# Altium project uz_frontpanel_main.PrjPCB (part 2 of 3)

## Sheet FPC-isoIOs-IOpSingle.SchDoc
size A4; SheetNumber: 8; SheetTotal: 15
Used 16 times, as channels U_FrontPanelConnectors/U_FPC-isoIOs/U_FPC-isoIOs-IOpQuad0104/IOp1, U_FrontPanelConnectors/U_FPC-isoIOs/U_FPC-isoIOs-IOpQuad0104/IOp2, U_FrontPanelConnectors/U_FPC-isoIOs/U_FPC-isoIOs-IOpQuad0104/IOp3, U_FrontPanelConnectors/U_FPC-isoIOs/U_FPC-isoIOs-IOpQuad0104/IOp4, U_FrontPanelConnectors/U_FPC-isoIOs/U_FPC-isoIOs-IOpQuad0508/IOp1, U_FrontPanelConnectors/U_FPC-isoIOs/U_FPC-isoIOs-IOpQuad0508/IOp2, U_FrontPanelConnectors/U_FPC-isoIOs/U_FPC-isoIOs-IOpQuad0508/IOp3, U_FrontPanelConnectors/U_FPC-isoIOs/U_FPC-isoIOs-IOpQuad0508/IOp4, U_FrontPanelConnectors/U_FPC-isoIOs/U_FPC-isoIOs-IOpQuad0912/IOp1, U_FrontPanelConnectors/U_FPC-isoIOs/U_FPC-isoIOs-IOpQuad0912/IOp2, U_FrontPanelConnectors/U_FPC-isoIOs/U_FPC-isoIOs-IOpQuad0912/IOp3, U_FrontPanelConnectors/U_FPC-isoIOs/U_FPC-isoIOs-IOpQuad0912/IOp4, U_FrontPanelConnectors/U_FPC-isoIOs/U_FPC-isoIOs-IOpQuad1316/IOp1, U_FrontPanelConnectors/U_FPC-isoIOs/U_FPC-isoIOs-IOpQuad1316/IOp2, U_FrontPanelConnectors/U_FPC-isoIOs/U_FPC-isoIOs-IOpQuad1316/IOp3, U_FrontPanelConnectors/U_FPC-isoIOs/U_FPC-isoIOs-IOpQuad1316/IOp4. Parts and nets are listed once, with the designators drawn on the sheet.
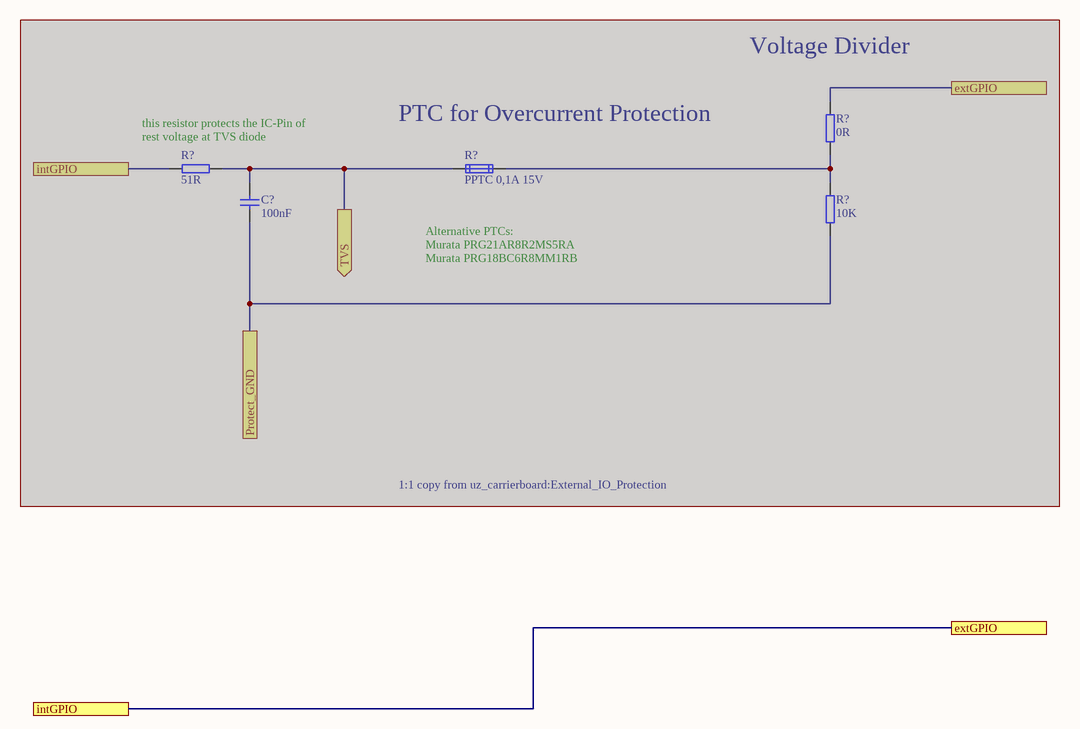
[diagram p8: FPC-isoIOs-IOpSingle.SchDoc]

### Parts
(Parts that share a designator on the sheet are numbered #1, #2 ... from top to bottom, then left to right.)
C?  100nF  [CAPC1608X90N_V]  (masked out: inside a compile mask, not in the netlist)
R?#1  0R  [RESC1608X55N_V]  (masked out: inside a compile mask, not in the netlist)
R?#2  51R  [RESC1608X55N_V]  (masked out: inside a compile mask, not in the netlist)
R?#3  PPTC 0,1A 15V  [RESC2012X85N]  (masked out: inside a compile mask, not in the netlist)
R?#4  10K  [RESC1608X55N_V]  (masked out: inside a compile mask, not in the netlist)

### Ports
extGPIO, intGPIO, Protect_GND, TVS (out)

### Nets
extGPIO: port intGPIO, port extGPIO

### Channels
U_FrontPanelConnectors/U_FPC-isoIOs/U_FPC-isoIOs-IOpQuad0104/IOp1: designators C?=C?A R?=R?A#3 R?=R?A#2 R?=R?A#4 R?=R?A#1; ports extGPIO=pExtStop intGPIO=pExtStop
U_FrontPanelConnectors/U_FPC-isoIOs/U_FPC-isoIOs-IOpQuad0104/IOp2: designators C?=C?B R?=R?B#3 R?=R?B#2 R?=R?B#4 R?=R?B#1; ports extGPIO=Extra01 intGPIO=Extra01
U_FrontPanelConnectors/U_FPC-isoIOs/U_FPC-isoIOs-IOpQuad0104/IOp3: designators C?=C?C R?=R?C#3 R?=R?C#2 R?=R?C#4 R?=R?C#1; ports extGPIO=Extra02 intGPIO=Extra02
U_FrontPanelConnectors/U_FPC-isoIOs/U_FPC-isoIOs-IOpQuad0104/IOp4: designators C?=C?D R?=R?D#3 R?=R?D#2 R?=R?D#4 R?=R?D#1; ports extGPIO=IO01 intGPIO=IO01
U_FrontPanelConnectors/U_FPC-isoIOs/U_FPC-isoIOs-IOpQuad0508/IOp1: designators C?=C?E R?=R?E#3 R?=R?E#2 R?=R?E#4 R?=R?E#1; ports extGPIO=IO02 intGPIO=IO02
U_FrontPanelConnectors/U_FPC-isoIOs/U_FPC-isoIOs-IOpQuad0508/IOp2: designators C?=C?F R?=R?F#3 R?=R?F#2 R?=R?F#4 R?=R?F#1; ports extGPIO=IO03 intGPIO=IO03
U_FrontPanelConnectors/U_FPC-isoIOs/U_FPC-isoIOs-IOpQuad0508/IOp3: designators C?=C?G R?=R?G#3 R?=R?G#2 R?=R?G#4 R?=R?G#1; ports extGPIO=IO04 intGPIO=IO04
U_FrontPanelConnectors/U_FPC-isoIOs/U_FPC-isoIOs-IOpQuad0508/IOp4: designators C?=C?H R?=R?H#3 R?=R?H#2 R?=R?H#4 R?=R?H#1; ports extGPIO=IO05 intGPIO=IO05
U_FrontPanelConnectors/U_FPC-isoIOs/U_FPC-isoIOs-IOpQuad0912/IOp1: designators C?=C?I R?=R?I#3 R?=R?I#2 R?=R?I#4 R?=R?I#1; ports extGPIO=IO06 intGPIO=IO06
U_FrontPanelConnectors/U_FPC-isoIOs/U_FPC-isoIOs-IOpQuad0912/IOp2: designators C?=C?J R?=R?J#3 R?=R?J#2 R?=R?J#4 R?=R?J#1; ports extGPIO=IO07 intGPIO=IO07
U_FrontPanelConnectors/U_FPC-isoIOs/U_FPC-isoIOs-IOpQuad0912/IOp3: designators C?=C?K R?=R?K#3 R?=R?K#2 R?=R?K#4 R?=R?K#1; ports extGPIO=IO08 intGPIO=IO08
U_FrontPanelConnectors/U_FPC-isoIOs/U_FPC-isoIOs-IOpQuad0912/IOp4: designators C?=C?L R?=R?L#3 R?=R?L#2 R?=R?L#4 R?=R?L#1; ports extGPIO=FlexIO01 intGPIO=FlexIO01
U_FrontPanelConnectors/U_FPC-isoIOs/U_FPC-isoIOs-IOpQuad1316/IOp1: designators C?=C?M R?=R?M#3 R?=R?M#2 R?=R?M#4 R?=R?M#1; ports extGPIO=FlexIO02 intGPIO=FlexIO02
U_FrontPanelConnectors/U_FPC-isoIOs/U_FPC-isoIOs-IOpQuad1316/IOp2: designators C?=C?N R?=R?N#3 R?=R?N#2 R?=R?N#4 R?=R?N#1; ports extGPIO=FlexIO03 intGPIO=FlexIO03
U_FrontPanelConnectors/U_FPC-isoIOs/U_FPC-isoIOs-IOpQuad1316/IOp3: designators C?=C?O R?=R?O#3 R?=R?O#2 R?=R?O#4 R?=R?O#1; ports extGPIO=FlexIO04 intGPIO=FlexIO04
U_FrontPanelConnectors/U_FPC-isoIOs/U_FPC-isoIOs-IOpQuad1316/IOp4: designators C?=C?P R?=R?P#3 R?=R?P#2 R?=R?P#4 R?=R?P#1; ports extGPIO=FlexIO05 intGPIO=FlexIO05

### Notes on the sheet
- Voltage Divider
- (near R?#2) this resistor protects the IC-Pin of rest voltage at TVS diode
- (near R?#3) PTC for Overcurrent Protection
- Alternative PTCs:
  Murata PRG21AR8R2MS5RA
  Murata PRG18BC6R8MM1RB
- 1:1 copy from uz_carrierboard:External_IO_Protection
- Title
- Revision:
- Design Engineer:
- Date:
- Project:
- Sheet
- of

### Library data of the parts
C? = 21382: KON 100nF 50V X7R ±10% SMD BF 1608 (0603); Value: 100n; AN: 21382; Mixed: SMT; Preferred: Yes; Temperature-Range: -55/+125; Tolerance: ±10%; Voltage: 50V; Technology: X7R; Case: 1608 (0603)
R?#1 = 21491: WID SMD 0R 0,1W 1% TK100  BF 1608 (0603); Value: 0; AN: 21491; Mixed: SMT; Tolerance: 1%; Case: 1608 (0603); Technology: TK100
R?#2 = 25938: WID SMD 51R 1% 0,1W  BF 1608 (0603); Value: 51; AN: 25938; Mixed: SMT; Preferred: Yes; Tolerance: 1%; Case: 1608 (0603); Technology: TK100
R?#3 = 28044: PTC Resettable Fuse 0.1A 15V SMD 0805; AN: 28044; Mixed: SMT; H-ART: MF-PSMF010X-2; Value: 0.1A; HelpURL: B:\AD\adlib\datasheet\MF-PSMF; Case: 2012 (0805); Voltage: 15V; Extra: MF-PSMF010X-2
R?#4 = 21492: WID SMD 10K 1% 0,1W  BF 1608 (0603); AN: 21492; Mixed: SMT; Preferred: Yes; Value: 10K; Tolerance: 1%; Case: 1608 (0603); Technology: TK100

## Sheet FPC-isoIOs-Power_Protection_AP22653.SchDoc
size A4; SheetNumber: 9; SheetTotal: 15
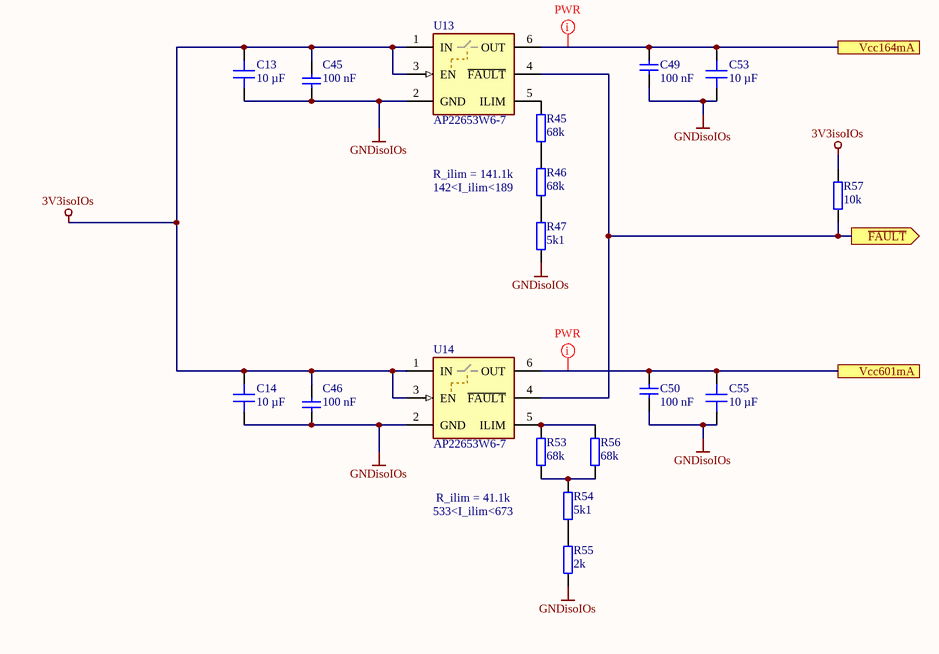
[diagram p9: FPC-isoIOs-Power_Protection_AP22653.SchDoc]

### Parts
C13  10 µF  [C_0603_TE]
C14  10 µF  [C_0603_TE]
C45  100 nF  [C_0603_TE]
C46  100 nF  [C_0603_TE]
C49  100 nF  [C_0603_TE]
C50  100 nF  [C_0603_TE]
C53  10 µF  [C_0603_TE]
C55  10 µF  [C_0603_TE]
R45  68k  [R_0603_TE]
R46  68k  [R_0603_TE]
R47  5k1  [R_0603_TE]
R53  68k  [R_0603_TE]
R54  5k1  [R_0603_TE]
R55  2k  [R_0603_TE]
R56  68k  [R_0603_TE]
R57  10k  [R_0603_TE]
U13  AP22653W6-7  [TSOT26-6]
U14  AP22653W6-7  [TSOT26-6]

### Ports
Vcc164mA, Vcc601mA, ~{FAULT} (out)

### Nets
3V3isoIOs: C13.2 C14.2 C45.1 C46.1 R57.2 U13.1(IN) U13.3(EN) U14.1(IN) U14.3(EN)
3V3isoIOs1: C49.1 C53.2 U13.6(OUT) ; port Vcc164mA
3V3isoIOs2: C50.1 C55.2 U14.6(OUT) ; port Vcc601mA
GNDisoIOs: C13.1 C14.1 C45.2 C46.2 C49.2 C50.2 C53.1 C55.1 R47.1 R55.1 U13.2(GND) U14.2(GND)
~{FAULT}: R57.1 U13.4(~{FAULT}) U14.4(~{FAULT}) ; port ~{FAULT}
NetR45_1: R45.1 R46.2
NetR45_2: R45.2 U13.5(ILIM)
NetR46_1: R46.1 R47.2
NetR53_1: R53.1 R54.2 R56.1
NetR53_2: R53.2 R56.2 U14.5(ILIM)
NetR54_1: R54.1 R55.2

### Layout directives
net class PWR: 3V3isoIOs1, 3V3isoIOs2

### Notes on the sheet
- R_ilim = 141.1k
- 142<I_ilim<189
- R_ilim = 41.1k
- 533<I_ilim<673
- Title
- Revision:
- Design Engineer:
- Date:
- Project:
- Sheet
- of

### Library data of the parts
C13 C14 C53 C55 = CL10A106MO8NQNC: as C24 on sheet FPC-isoIOs; Manufacturer Part Number: CL10A106MO8NQNC; PartID: 101; Created On: 22/08/2022 13:56:44; ComponentLink1Description: Datasheet; ComponentLink1URL: https://datasheet.lcsc.com/lcsc/1810261909_Samsung-Electro-Mechanics-CL10A106MO8NQNC_C92487.pdf; Component Type: Capacitor 0603; Device Package: 0603; Last Updated: 19/11/2024 12:40:46; Mounting Type: SMD; Operating Temperature: -55 - 85°C; Series: X5R; Supplier 1: LCSC; Supplier Part Number 1: C92487; Type: Capacitor; Value: 10 µF; Live Cycle Status: 1; LCSC Part Number: C92487
C45 C46 C49 C50 = UZgen_C_0603_100nF_50V_X7R: as C21 on sheet FPC-isoIOs; Manufacturer Part Number: UZgen_C_0603_100nF_50V_X7R; PartID: 1; Created On: 02/07/2024 14:42:23; Value: 100 nF; Device Package: 0603; Technology: X7R; Mounting Type: SMD; Last Updated: 08/08/2024 15:01:15
R45 R46 R53 R56 = UZgen_R_0603_68k: Generic resistor; Manufacturer: UZgen; Tolerance: 1 %; Created from: UZgenTool; Manufacturer Part Number: UZgen_R_0603_68k; PartID: 264; Created On: 02/07/2024 17:29:50; Value: 68k; Device Package: 0603; Mounting Type: SMD; Last Updated: 02/07/2024 17:29:50
R47 R54 = UZgen_R_0603_5k1: Generic resistor; Manufacturer: UZgen; Tolerance: 1 %; Created from: UZgenTool; Manufacturer Part Number: UZgen_R_0603_5k1; PartID: 238; Created On: 02/07/2024 17:29:50; Value: 5k1; Device Package: 0603; Mounting Type: SMD; Last Updated: 02/07/2024 17:29:50
R55 = UZgen_R_0603_2k: Generic resistor; Manufacturer: UZgen; Tolerance: 1 %; Created from: UZgenTool; Manufacturer Part Number: UZgen_R_0603_2k; PartID: 228; Created On: 02/07/2024 17:29:49; Value: 2k; Device Package: 0603; Mounting Type: SMD; Last Updated: 02/07/2024 17:29:49
R57 = UZgen_R_0603_10k: as R18 on sheet FPC-isoIOs; Manufacturer Part Number: UZgen_R_0603_10k; PartID: 1; Created On: 02/07/2024 14:34:53; Value: 10k; Device Package: 0603; Mounting Type: SMD; Last Updated: 02/07/2024 14:37:16
U13 U14 = AP22653W6-7: Precision Adjustable Current-limited Power Switch; Manufacturer: Diodes Incorporated; Created from: MGeier; Manufacturer Part Number: AP22653W6-7; PartID: 10; Created On: 10/04/2025 19:40:00; ComponentLink1Description: Datasheet; ComponentLink1URL: https://www.diodes.com/datasheet/download/AP22652_AP22653_AP22652A_AP22653A.pdf; ComponentLink2Description: Homepage; ComponentLink2URL: https://www.diodes.com/part/view/AP22653; Component Type: Power Switch ICs; Device Package: SOT26; Last Updated: 11/04/2025 15:13:45; Mounting Type: SMD; Operating Temperature: -40 to +125 °C; Series: AP22652/AP22653/AP22652A/AP22653A; Supplier 1: LCSC; Supplier Part Number 1: C2158037; Value: AP22653W6-7; LCSC Part Number: C2158037

## Sheet ETH-PHY_SGMII.SchDoc
size A4; Organization: UltraZohm; SheetNumber: 11; SheetTotal: 15
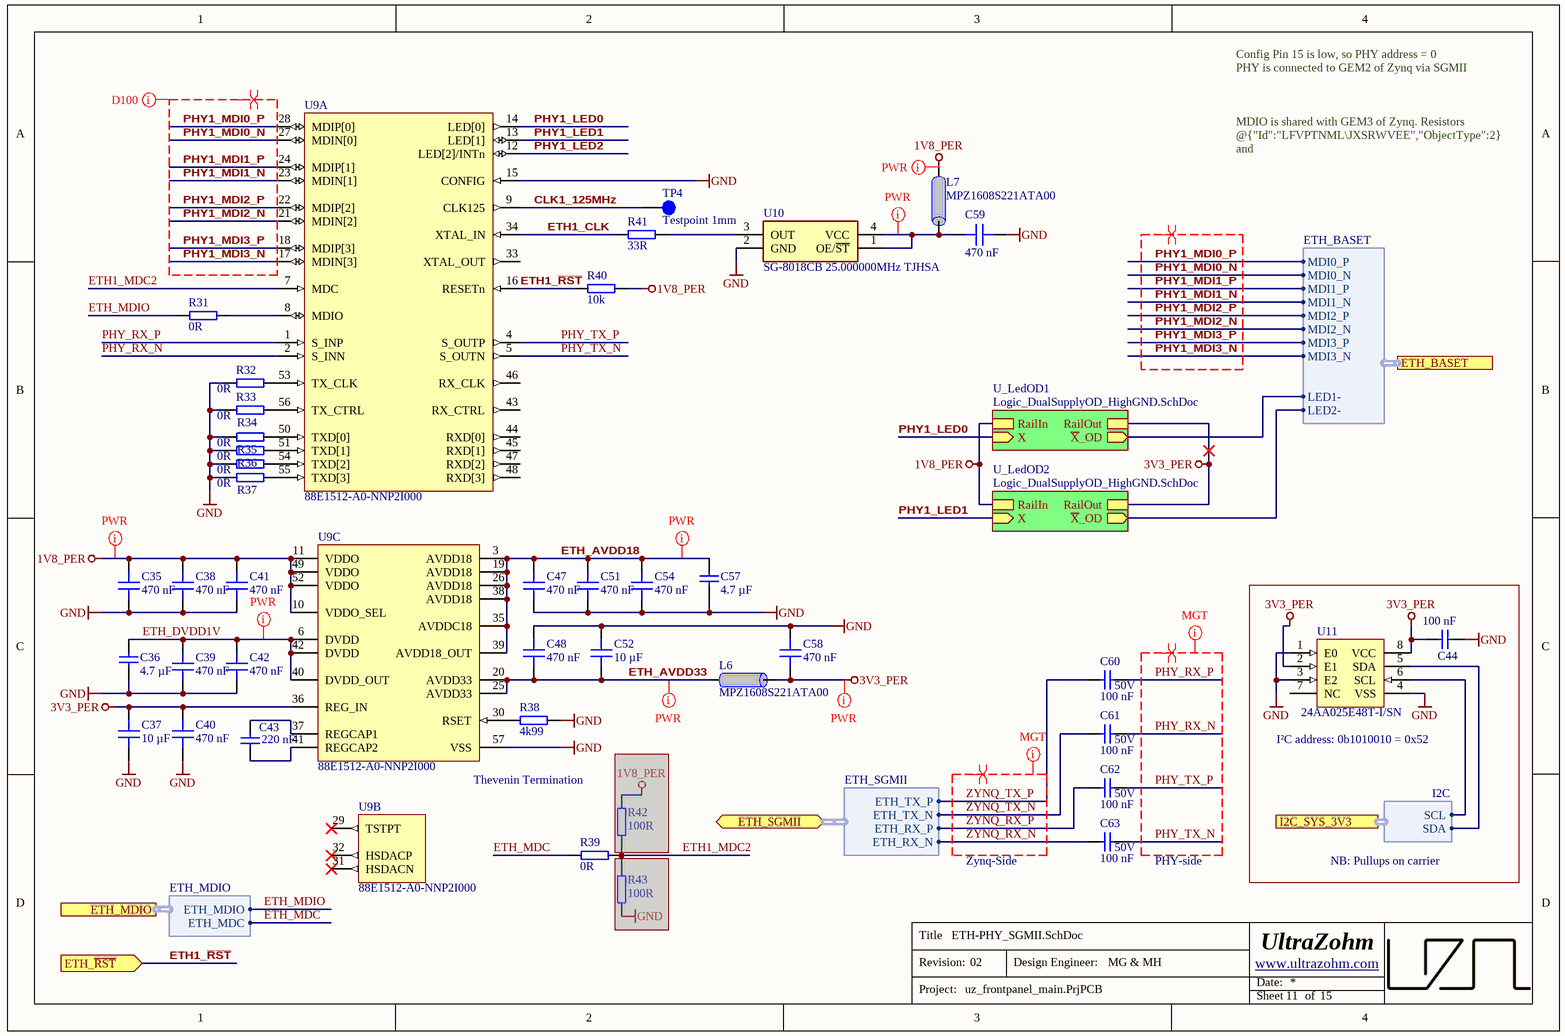
[diagram p10: ETH-PHY_SGMII.SchDoc]

### Parts
(Parts that share a designator on the sheet are numbered #1, #2 ... from top to bottom, then left to right.)
C35  470 nF  [C_0603_TE]
C36  4.7 µF  [C_0603_TE]
C37  10 µF  [C_0603_TE]
C38  470 nF  [C_0603_TE]
C39  470 nF  [C_0603_TE]
C40  470 nF  [C_0603_TE]
C41  470 nF  [C_0603_TE]
C42  470 nF  [C_0603_TE]
C43  220 nF  [C_0603_TE]
C44  100 nF  [C_0603_TE]
C47  470 nF  [C_0603_TE]
C48  470 nF  [C_0603_TE]
C51  470 nF  [C_0603_TE]
C52  10 µF  [C_0603_TE]
C54  470 nF  [C_0603_TE]
C57  4.7 µF  [C_0603_TE]
C58  470 nF  [C_0603_TE]
C59  470 nF  [C_0603_TE]
C60  100 nF  Voltage: 50V  [C_0402_TE]
C61  100 nF  Voltage: 50V  [C_0402_TE]
C62  100 nF  Voltage: 50V  [C_0402_TE]
C63  100 nF  Voltage: 50V  [C_0402_TE]
L6  MPZ1608S221ATA00  [RES 0603_1608]
L7  MPZ1608S221ATA00  [RES 0603_1608]
R31  0R  [R_0603_TE]
R32  0R  [R_0603_TE]
R33  0R  [R_0603_TE]
R34  0R  [R_0603_TE]
R35  0R  [R_0603_TE]
R36  0R  [R_0603_TE]
R37  0R  [R_0603_TE]
R38  4k99  [RES 0603_1608]
R39  0R  [R_0603_TE]
R40  10k  [R_0603_TE]
R41  33R  [R_0603_TE]
R42#2  100R  [R_0603_TE]  (masked out: inside a compile mask, not in the netlist)
R43#2  100R  [R_0603_TE]  (masked out: inside a compile mask, not in the netlist)
TP4  Testpoint 1mm  [TP_1mm]  (no BOM)
U9  88E1512-A0-NNP2I000  [QFN50P800X800X100-57N]  (parts A,B,C of 3)
U10  SG-8018CB 25.000000MHz TJHSA  [SMD5032-4P]
U11  24AA025E48T-I/SN  [D0008A_N]

### Sub-sheets
U_LedOD1 = Logic_DualSupplyOD_HighGND.SchDoc (file not in this document): RailIn, RailOut, X (in), ~{X}_OD (out)
U_LedOD2 = Logic_DualSupplyOD_HighGND.SchDoc (file not in this document): RailIn, RailOut, X (in), ~{X}_OD (out)

### Ports
ETH_BASET (harness ETH_BASET), ETH_MDIO (harness ETH_MDIO), ETH_SGMII (bidir, harness ETH_SGMII), ETH_~{RST} (in), I2C_SYS_3V3 (harness I2C)

### Harnesses
ETH_SGMII: ETH_RX_N, ETH_RX_P, ETH_TX_N, ETH_TX_P
ETH_MDIO: ETH_MDC, ETH_MDIO
ETH_BASET: MDI0_P, MDI0_N, MDI1_P, MDI1_N, MDI2_P, MDI2_N, MDI3_P, MDI3_N, LED1-, LED2-
I2C: SCL, SDA

### Nets
1V8_PER: C35.1 C38.1 C41.1 L7.1 R40.2 U9.10(VDDO_SEL) U9.11(VDDO) U9.49(VDDO) U9.52(VDDO) ; sheet U_LedOD1/RailIn, sheet U_LedOD2/RailIn
3V3_PER: C37.1 C40.1 C44.1 C58.2 L6.2 U9.36(REG_IN) U11.2(E1) U11.8(VCC) ; sheet U_LedOD1/RailOut, sheet U_LedOD2/RailOut
GND: C35.2 C36.2 C37.2 C38.2 C39.2 C40.2 C41.2 C42.2 C44.2 C47.2 C48.1 C51.2 C52.1 C54.2 C57.2 C58.1 C59.1 R32.1 R33.1 R34.1 R35.1 R36.1 R37.1 R38.1 U9.15(CONFIG) U9.57(VSS) U10.2(GND) U11.1(E0) U11.3(E2) U11.4(VSS)
1R_LED1-: sheet U_LedOD1/~{X}_OD, port ETH_BASET.LED1-
1R_LED2-: sheet U_LedOD2/~{X}_OD, port ETH_BASET.LED2-
CLK1_125MHz: TP4.1 U9.9(CLK125)
ETH1_CLK: R41.1 U9.34(XTAL_IN)
ETH1_MDC2: R39.2 U9.7(MDC)
ETH1_~{RST}: R40.1 U9.16(RESETn) ; port ETH_~{RST}
ETH_AVDD18: C47.1 C51.1 C54.1 C57.1 U9.3(AVDD18) U9.19(AVDD18) U9.26(AVDD18) U9.35(AVDDC18) U9.38(AVDD18) U9.39(AVDD18_OUT)
ETH_AVDD33: C48.2 C52.2 L6.1 U9.20(AVDD33) U9.25(AVDD33)
ETH_DVDD1V: C36.1 C39.1 C42.1 U9.6(DVDD) U9.40(DVDD_OUT) U9.42(DVDD)
ETH_MDC: R39.1 ; port ETH_MDIO.ETH_MDC  [project net ETH1_MDC]
ETH_MDIO: R31.1 ; port ETH_MDIO.ETH_MDIO  [project net ETH1_MDIO]
I2C_SYS_3V3.SCL: U11.6(SCL) ; port I2C_SYS_3V3.SCL
I2C_SYS_3V3.SDA: U11.5(SDA) ; port I2C_SYS_3V3.SDA
PHY1_LED0: U9.14(LED[0]) ; sheet U_LedOD1/X
PHY1_LED1: U9.13(LED[1]) ; sheet U_LedOD2/X
PHY1_LED2: U9.12(LED[2]/INTn)
PHY1_MDI0_N: U9.27(MDIN[0]) ; port ETH_BASET.MDI0_N  [project net MDI1R_0_N]
PHY1_MDI0_P: U9.28(MDIP[0]) ; port ETH_BASET.MDI0_P  [project net MDI1R_0_P]
PHY1_MDI1_N: U9.23(MDIN[1]) ; port ETH_BASET.MDI1_N  [project net MDI1R_1_N]
PHY1_MDI1_P: U9.24(MDIP[1]) ; port ETH_BASET.MDI1_P  [project net MDI1R_1_P]
PHY1_MDI2_N: U9.21(MDIN[2]) ; port ETH_BASET.MDI2_N  [project net MDI1R_2_N]
PHY1_MDI2_P: U9.22(MDIP[2]) ; port ETH_BASET.MDI2_P  [project net MDI1R_2_P]
PHY1_MDI3_N: U9.17(MDIN[3]) ; port ETH_BASET.MDI3_N  [project net MDI1R_3_N]
PHY1_MDI3_P: U9.18(MDIP[3]) ; port ETH_BASET.MDI3_P  [project net MDI1R_3_P]
PHY_RX_N: C61.2 U9.2(S_INN)
PHY_RX_P: C60.2 U9.1(S_INP)
PHY_TX_N: C63.2 U9.5(S_OUTN)
PHY_TX_P: C62.2 U9.4(S_OUTP)
ZYNQ_RX_N: C63.1 ; port ETH_SGMII.ETH_RX_N  [project net GTR2_RX_N]
ZYNQ_RX_P: C62.1 ; port ETH_SGMII.ETH_RX_P  [project net GTR2_RX_P]
ZYNQ_TX_N: C61.1 ; port ETH_SGMII.ETH_TX_N  [project net GTR2_TX_N]
ZYNQ_TX_P: C60.1 ; port ETH_SGMII.ETH_TX_P  [project net GTR2_TX_P]
NetC43_1: C43.1 U9.37(REGCAP1)
NetC43_2: C43.2 U9.41(REGCAP2)
NetC59_2: C59.2 L7.2 U10.1(OE/~{ST}) U10.4(VCC)
NetR31_2: R31.2 U9.8(MDIO)
NetR32_2: R32.2 U9.53(TX_CLK)
NetR33_2: R33.2 U9.56(TX_CTRL)
NetR34_2: R34.2 U9.50(TXD[0])
NetR35_2: R35.2 U9.51(TXD[1])
NetR36_2: R36.2 U9.54(TXD[2])
NetR37_2: R37.2 U9.55(TXD[3])
NetR38_2: R38.2 U9.30(RSET)
NetR41_2: R41.2 U10.3(OUT)

Not connected (* = marked no-connect by the designer): U9 29(TSTPT)* 31(HSDACN)* 32(HSDACP)* 33(XTAL_OUT) 43(RX_CTRL) 44(RXD[0]) 45(RXD[1]) 46(RX_CLK) 47(RXD[2]) 48(RXD[3]); U11 7(NC)

### Layout directives
differential pair: PHY1_MDI0_N, PHY1_MDI0_P, PHY1_MDI1_N, PHY1_MDI1_P, PHY1_MDI2_N, PHY1_MDI2_P, PHY1_MDI3_N, PHY1_MDI3_P, PHY_RX_N, PHY_RX_P, PHY_TX_N, PHY_TX_P, ZYNQ_RX_N, ZYNQ_RX_P, ZYNQ_TX_N, ZYNQ_TX_P
net class D100: PHY1_MDI0_N, PHY1_MDI0_P, PHY1_MDI1_N, PHY1_MDI1_P, PHY1_MDI2_N, PHY1_MDI2_P, PHY1_MDI3_N, PHY1_MDI3_P
net class MGT: PHY_RX_N, PHY_RX_P, PHY_TX_N, PHY_TX_P, ZYNQ_RX_N, ZYNQ_RX_P, ZYNQ_TX_N, ZYNQ_TX_P
net class PWR: 1V8_PER, 3V3_PER, ETH_AVDD18, ETH_AVDD33, ETH_DVDD1V, NetC59_2

### Notes on the sheet
- Config Pin 15 is low, so PHY address = 0
  PHY is connected to GEM2 of Zynq via SGMII
  MDIO is shared with GEM3 of Zynq. Resistors @{"Id":"LFVPTNML\JXSRWVEE","ObjectType":2} and @{"Id":"LFVPTNML\HYAPWXBM","ObjectType":2} need to be soldered with 0R to be connected to the MDIO Bus
- Thevenin Termination
- (near U11) I²C address: 0b1010010 = 0x52
- Zynq-Side
- (near C63) PHY-side
- NB: Pullups on carrier
- Title
- Revision:
- Design Engineer:
- Date:
- Project:
- Sheet
- of

### Library data of the parts
C35 C38-C42 C47 C48 C51 C54 C58 C59 = CL10A474KB8NNNC: Capacitor 0603, 50 VDC, 470 nF, X5R; Manufacturer: Samsung Electro-Mechanics; Tolerance: 10 %; Voltage Rating: 50 VDC; Created from: AGeiger; Manufacturer Part Number: CL10A474KB8NNNC; PartID: 103; Created On: 22/08/2022 14:44:45; ComponentLink1Description: Datasheet; ComponentLink1URL: https://datasheet.lcsc.com/lcsc/1810191213_Samsung-Electro-Mechanics-CL10A474KB8NNNC_C170149.pdf; Component Type: Capacitor 0603; Device Package: 0603; Last Updated: 22/04/2025 15:48:45; Mounting Type: SMD; Operating Temperature: -55 - 85°C; Series: X5R; Supplier 1: LCSC; Supplier Part Number 1: C170149; Supplier 2: Mouser; Supplier Part Number 2: 187-CL10A474KB8NNNC; Type: Capacitor; Value: 470 nF; Live Cycle Status: 1; LCSC Part Number: C170149
C36 C57 = UZgen_C_0603_4.7uF_16V_X5R: Generic capacitor; Manufacturer: UZgen; Tolerance: 10 %; Created from: MGeier; Voltage: 16V; Manufacturer Part Number: UZgen_C_0603_4.7uF_16V_X5R; PartID: 5809; Created On: 20/03/2025 14:43:45; Device Package: 0603; Last Updated: 20/03/2025 14:43:45; Mounting Type: SMD; Value: 4.7 µF; Technology: X5R
C37 C52 = CL10A106MO8NQNC: as C24 on sheet FPC-isoIOs; Manufacturer Part Number: CL10A106MO8NQNC; PartID: 101; Created On: 22/08/2022 13:56:44; ComponentLink1Description: Datasheet; ComponentLink1URL: https://datasheet.lcsc.com/lcsc/1810261909_Samsung-Electro-Mechanics-CL10A106MO8NQNC_C92487.pdf; Component Type: Capacitor 0603; Device Package: 0603; Last Updated: 19/11/2024 12:40:46; Mounting Type: SMD; Operating Temperature: -55 - 85°C; Series: X5R; Supplier 1: LCSC; Supplier Part Number 1: C92487; Type: Capacitor; Value: 10 µF; Live Cycle Status: 1; LCSC Part Number: C92487
C43 = UZgen_C_0603_220nF_50V_X7R: Generic capacitor; Manufacturer: UZgen; Tolerance: 10 %; Voltage: 50V; Created from: UZgenTool; Value: 220 nF; Technology: X7R; Manufacturer Part Number: UZgen_C_0603_220nF_50V_X7R; PartID: 2; Created On: 02/07/2024 14:42:23; Device Package: 0603; Mounting Type: SMD; Last Updated: 08/08/2024 15:01:15
C44 = UZgen_C_0603_100nF_50V_X7R: as C21 on sheet FPC-isoIOs; Manufacturer Part Number: UZgen_C_0603_100nF_50V_X7R; PartID: 1; Created On: 02/07/2024 14:42:23; Value: 100 nF; Device Package: 0603; Technology: X7R; Mounting Type: SMD; Last Updated: 08/08/2024 15:01:15
C60-C63 = UZgen_C_0402_100nF_50V_X7R: Generic capacitor; Manufacturer: UZgen; Tolerance: 10 %; Created from: UZgenTool; Technology: X7R; Value: 100 nF; Manufacturer Part Number: UZgen_C_0402_100nF_50V_X7R; PartID: 3431; Created On: 02/08/2024 11:17:51; Device Package: 0402; Mounting Type: SMD; Last Updated: 02/08/2024 11:17:51
L6 L7 = MPZ1608S221ATA00: Ferritperle, 0603, 220 ohm, 2.2 A, Baureihe MPZ, 0.05 ohm, ± 25%; Manufacturer: TDK; Value: 220 Ohm; Type: Ferrite; DC current: 2.2 A; Created from: MGremer; Manufacturer Part Number: MPZ1608S221ATA00; PartID: 3; Created On: 08/06/2021 11:33:39; ComponentLink1Description: Datasheet; ComponentLink1URL: http://www.farnell.com/datasheets/2291439.pdf; Component Type: Ferritperle; Device Package: 0603; Last Updated: 12/07/2024 17:26:54; Mounting Type: SMD; Operating Temperature: -55 - 125 °C; Series: MPZ; Supplier 1: Farnell; Supplier Part Number 1: 1301677RL; Live Cycle Status: 1; LCSC Part Number: C76815; Stock number: not stored
R31-R37 R39 = UZgen_R_0603_0R: Generic resistor; Manufacturer: UZgen; Tolerance: 1 %; Created from: UZgenTool; Value: 0R; Manufacturer Part Number: UZgen_R_0603_0R; PartID: 581; Created On: 08/07/2024 14:34:30; Device Package: 0603; Mounting Type: SMD; Last Updated: 08/07/2024 14:34:30
R38 = RC0603FR-074K99L: 100mW Thick Film Resistors 75V ±100ppm/℃ ±1% 4.99kΩ 0603 Chip Resistor - Surface Mount ROHS; Manufacturer: YAGEO; Created from: NDiringer; Tolerance: 1%; Value: 4k99; Manufacturer Part Number: RC0603FR-074K99L; PartID: 352; Created On: 17/08/2022 08:08:34; ComponentLink1Description: Datasheet; ComponentLink1URL: https://www.lcsc.com/datasheet/lcsc_datasheet_2304140030_YAGEO-RC0603FR-074K99L_C114621.pdf; Component Type: SMD resistor; Device Package: 0603; Last Updated: 17/08/2022 08:08:34; Mounting Type: SMD; Supplier 1: LCSC/JLCPCB; Supplier Part Number 1: C114621; Type: Resistor; Live Cycle Status: 1; Stock number: not stored; LCSC Part Number: C114621
R40 = UZgen_R_0603_10k: as R18 on sheet FPC-isoIOs; Value: 10k; Manufacturer Part Number: UZgen_R_0603_10k; PartID: 1; Created On: 02/07/2024 14:34:53; Device Package: 0603; Mounting Type: SMD; Last Updated: 02/07/2024 14:37:16
R41 = UZgen_R_0603_33R: Generic resistor; Manufacturer: UZgen; Tolerance: 1 %; Created from: UZgenTool; Value: 33R; Manufacturer Part Number: UZgen_R_0603_33R; PartID: 185; Created On: 02/07/2024 17:29:48; Device Package: 0603; Mounting Type: SMD; Last Updated: 02/07/2024 17:29:48
R42#2 R43#2 = UZgen_R_0603_100R: Generic resistor; Manufacturer: UZgen; Tolerance: 1 %; Created from: UZgenTool; Value: 100R; Manufacturer Part Number: UZgen_R_0603_100R; PartID: 197; Created On: 02/07/2024 17:29:48; Device Package: 0603; Mounting Type: SMD; Last Updated: 02/07/2024 17:29:48
TP4 = NULL: Manufacturer Part Number: NULL; Created from: AGeiger; Created: 2018_06_25_AGeiger; Value: Testpoint 1mm; PartID: 9; Created On: 20/09/2022 13:14:57; Component Type: Testpoint; Last Updated: 20/09/2022 13:15:39; Manufacturer: NULL; Supplier 1: NULL; Supplier Part Number 1: NULL; Type: Testpoint; Live Cycle Status: 1
U9 = 88E1512-A0-NNP2I000: Ethernet ICs Single-Port EEE GE PHY w/SGMII in 56-pin QFN; Manufacturer: Marvell; Created from: MGremer; Manufacturer Part Number: 88E1512-A0-NNP2I000; PartID: 1; Created On: 01/12/2020 16:21:41; ComponentLink1Description: Datasheet; ComponentLink1URL: https://www.mouser.de/datasheet/2/912/marvell-phys-transceivers-alaska-88e151x-datasheet-1360912.pdf; Component Type: Ethernet Single-Port; Device Package: QFN65; Last Updated: 26/06/2024 13:40:11; Mounting Type: SMD; Supplier 1: Mouser; Supplier Part Number 1: 348-88E1512A0NNP2I00; Type: Ethernet Single-Port; Live Cycle Status: 1; LCSC Part Number: C713256; Stock number: not stored
U10 = SG-8018CB 25.000000MHz TJHSA: ±50ppm 1.8V~3.3V 25MHz SMD5032-4P Programmable Oscillators ROHS; Manufacturer: Seiko Epson; Created from: FRosner; Manufacturer Part Number: SG-8018CB 25.000000MHz TJHSA; PartID: 3; Created On: 15/08/2024 10:38:39; ComponentLink1Description: Datasheet; ComponentLink1URL: https://download.epsondevice.com/td/pdf/app/SG-8018CB_en.pdf; Component Type: Oscillator; Device Package: 5032; Last Updated: 15/08/2024 10:38:39; Mounting Type: SMD; Operating Temperature: -40 to +105°C; Supplier 1: LCSC; Supplier Part Number 1: C390471; Value: 25 MHz; LCSC Part Number: C390471
U11 = 24AA025E48T-I/SN: 2Kbit I2C SOP-8 EEPROM ROHS; Manufacturer: Microchip Tech; Created from: FRosner; Manufacturer Part Number: 24AA025E48T-I/SN; PartID: 7; Created On: 07/09/2024 12:18:21; ComponentLink1Description: Datasheet; ComponentLink1URL: https://wmsc.lcsc.com/wmsc/upload/file/pdf/v2/lcsc/2202010930_Microchip-Tech-24AA025E48T-I-SN_C2060925.pdf; Component Type: EEPROM; Device Package: SOIC-8; Last Updated: 10/09/2024 09:33:15; Mounting Type: SMD; Operating Temperature: -40 to +85 °C; Series: 24AA025; Supplier 1: Mouser; Supplier Part Number 1: 579-24AA025E48T-I/SN; Supplier 2: LCSC; Supplier Part Number 2: C2060925; Type: Memory; Value: 24AA025E48T-I/SN; LCSC Part Number: C2060925

## Sheet PCB-FirstFloor.SchDoc
size A4; SheetNumber: 15; SheetTotal: 15
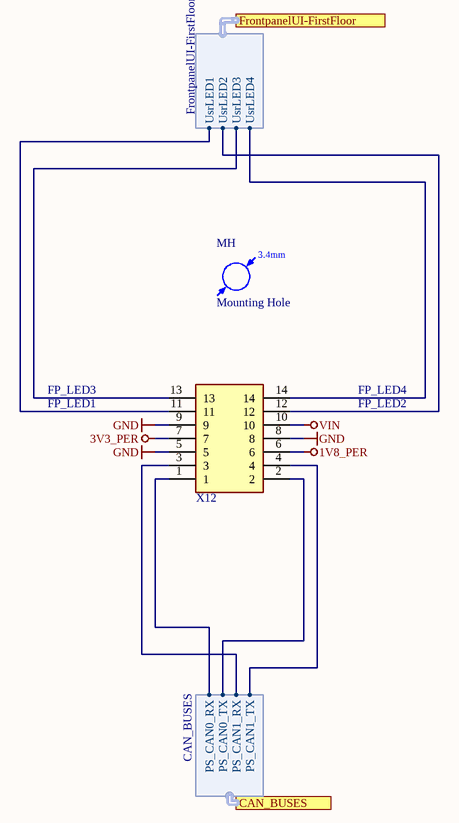
[diagram p11: PCB-FirstFloor.SchDoc]

### Parts
MH  Mounting Hole  [MH_3.4]  (no BOM)
X12  (no value)  [TE_215309-7]

### Ports
CAN_BUSES (harness CAN_BUSES), FrontpanelUI-FirstFloor (harness FrontpanelUI-FirstFloor)

### Harnesses
FrontpanelUI-FirstFloor: UsrLED1, UsrLED2, UsrLED3, UsrLED4
CAN_BUSES: PS_CAN0_RX, PS_CAN0_TX, PS_CAN1_RX, PS_CAN1_TX

### Nets
1V8_PER: X12.6
3V3_PER: X12.7
GND: X12.5 X12.8 X12.9
VIN: X12.10
CAN_BUSES.PS_CAN0_RX: X12.1 ; port CAN_BUSES.PS_CAN0_RX
CAN_BUSES.PS_CAN0_TX: X12.2 ; port CAN_BUSES.PS_CAN0_TX
CAN_BUSES.PS_CAN1_RX: X12.3 ; port CAN_BUSES.PS_CAN1_RX
CAN_BUSES.PS_CAN1_TX: X12.4 ; port CAN_BUSES.PS_CAN1_TX
FrontpanelUI-FF.UsrLED1: X12.11 ; port FrontpanelUI-FirstFloor.UsrLED1
FrontpanelUI-FF.UsrLED2: X12.12 ; port FrontpanelUI-FirstFloor.UsrLED2
FrontpanelUI-FF.UsrLED3: X12.13 ; port FrontpanelUI-FirstFloor.UsrLED3
FrontpanelUI-FF.UsrLED4: X12.14 ; port FrontpanelUI-FirstFloor.UsrLED4

### Notes on the sheet
- FP_LED1
- FP_LED3
- FP_LED2
- FP_LED4
- Title
- Revision:
- Design Engineer:
- Date:
- Project:
- Sheet
- of
- (in symbol Mounting Hole) 3.4mm

### Library data of the parts
MH = Mounting Hole: Created from: MHlatky; Manufacturer Part Number: Mounting Hole; PartID: 16; Created On: 26/01/2021 09:19:51; ComponentLink1Description: Datasheet; Component Type: Mounting Hole; Device Package: -; Last Updated: 21/03/2022 23:05:12; Manufacturer: Mounting Hole; Supplier 1: Mounting Hole; Supplier Part Number 1: Mounting Hole; Type: Mounting Hole; Value: Mounting Hole; Live Cycle Status: 1; Stock number: not stored
X12 = 2.54-2*7P: [low-cost] Headers & Wire Housings REC ASSY 2X7P VERT [NB: "2.54-2*7P" is not a unique MPN]; Manufacturer: Boom Precision Elec; Created from: FRosner/MGeier; Manufacturer Part Number: 2.54-2*7P; PartID: 42; Created On: 08/08/2024 12:14:20; ComponentLink1Description: Homepage; ComponentLink1URL: https://jlcpcb.com/partdetail/boomele_boom_Precision_elec-2_54_27P/C38844; ComponentLink2Description: Datasheet (related part, i.e., 16P version); ComponentLink2URL: https://wmsc.lcsc.com/wmsc/upload/file/pdf/v2/lcsc/2308171714_BOOMELE-Boom-Precision-Elec-2-54-2-8P_C30734.pdf; Last Updated: 08/08/2024 12:16:08; Mounting Type: THT; Supplier 1: LCSC; Supplier Part Number 1: C38844; Value: 2.54-2*7P; LCSC Part Number: C38844

## Sheet SSD.SchDoc
size A4; SheetNumber: 4; SheetTotal: 15
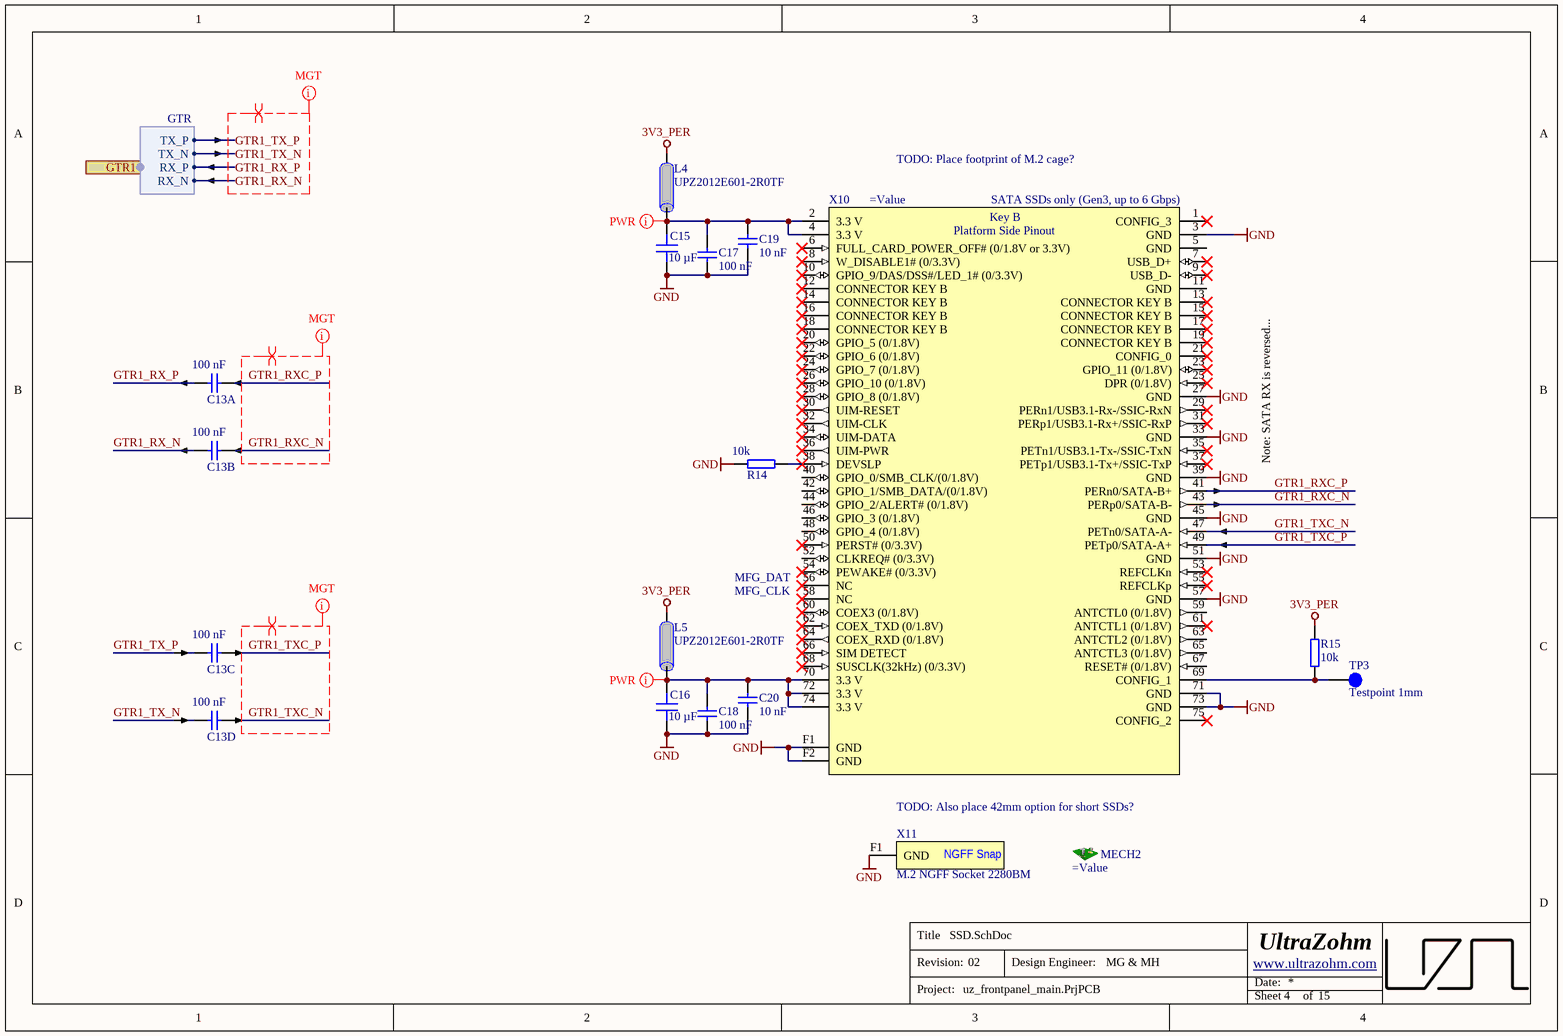
[diagram p12: SSD.SchDoc]

### Parts
C13A  100 nF  [C_0402_TE]
C13B  100 nF  [C_0402_TE]
C13C  100 nF  [C_0402_TE]
C13D  100 nF  [C_0402_TE]
C15  10 µF  [C_0603_TE]
C16  10 µF  [C_0603_TE]
C17  100 nF  [C_0603_TE]
C18  100 nF  [C_0603_TE]
C19  10 nF  [C_0603_TE]
C20  10 nF  [C_0603_TE]
L4  UPZ2012E601-2R0TF  [INDC2012X92N_V]
L5  UPZ2012E601-2R0TF  [INDC2012X92N_V]
MECH2  (no value)  [WA-SMSI-2.5mm]
R14  10k  [R_0603_TE]
R15  10k  [R_0603_TE]
TP3  Testpoint 1mm  [TP_1mm]  (no BOM)
X10  (no value)  [2199230-3]
X11  M.2 NGFF Socket 2280BM  [M.2-NGFF-Socket-2280BM]  (no BOM)

### Ports
GTR1 (harness GTR)

### Harnesses
GTR: RX_N, RX_P, TX_N, TX_P

### Nets
3V3_PER: L4.1 L5.1 R15.2
GND: C15.1 C16.1 C17.1 C18.1 C19.1 C20.1 R14.1 X10.3(GND) X10.27(GND) X10.33(GND) X10.39(GND) X10.45(GND) X10.51(GND) X10.57(GND) X10.71(GND) X10.73(GND) X10.F1(GND) X10.F2(GND) X11.F1(GND)
GTR1_RX_N: C13B.1 ; port GTR1.RX_N
GTR1_RX_P: C13A.1 ; port GTR1.RX_P
GTR1_RXC_N: C13B.2 X10.43(PERp0/SATA-B-)
GTR1_RXC_P: C13A.2 X10.41(PERn0/SATA-B+)
GTR1_TX_N: C13D.1 ; port GTR1.TX_N
GTR1_TX_P: C13C.1 ; port GTR1.TX_P
GTR1_TXC_N: C13D.2 X10.47(PETn0/SATA-A-)
GTR1_TXC_P: C13C.2 X10.49(PETp0/SATA-A+)
NetC15_2: C15.2 C17.2 C19.2 L4.2 X10.2(3.3_V) X10.4(3.3_V)
NetC16_2: C16.2 C18.2 C20.2 L5.2 X10.70(3.3_V) X10.72(3.3_V) X10.74(3.3_V)
NetR14_2: R14.2 X10.38(DEVSLP)
NetR15_1: R15.1 TP3.1 X10.69(CONFIG_1)

Not connected (* = marked no-connect by the designer): X10 1(CONFIG_3)* 5(GND) 6(FULL_CARD_POWER_OFF#_(0/1.8V_or_3.3V))* 7(USB_D+)* 8(W_DISABLE1#_(0/3.3V))* 9(USB_D-)* 10(GPIO_9/DAS/DSS#/LED_1#_(0/3.3V))* 11(GND) 12(CONNECTOR_KEY_B)* 13(CONNECTOR_KEY_B)* 14(CONNECTOR_KEY_B)* 15(CONNECTOR_KEY_B)* 16(CONNECTOR_KEY_B)* 17(CONNECTOR_KEY_B)* 18(CONNECTOR_KEY_B)* 19(CONNECTOR_KEY_B)* 20(GPIO_5_(0/1.8V))* 21(CONFIG_0)* 22(GPIO_6_(0/1.8V))* 23(GPIO_11_(0/1.8V))* 24(GPIO_7_(0/1.8V))* 25(DPR_(0/1.8V))* 26(GPIO_10_(0/1.8V))* 28(GPIO_8_(0/1.8V))* 29(PERn1/USB3.1-Rx-/SSIC-RxN)* 30(UIM-RESET)* 31(PERp1/USB3.1-Rx+/SSIC-RxP)* 32(UIM-CLK)* 34(UIM-DATA)* 35(PETn1/USB3.1-Tx-/SSIC-TxN)* 36(UIM-PWR)* 37(PETp1/USB3.1-Tx+/SSIC-TxP)* 40(GPIO_0/SMB_CLK/(0/1.8V)) 42(GPIO_1/SMB_DATA/(0/1.8V)) 44(GPIO_2/ALERT#_(0/1.8V)) 46(GPIO_3_(0/1.8V)) 48(GPIO_4_(0/1.8V)) 50(PERST#_(0/3.3V))* 52(CLKREQ#_(0/3.3V)) 53(REFCLKn)* 54(PEWAKE#_(0/3.3V))* 55(REFCLKp)* 56(NC)* 58(NC)* 59(ANTCTL0_(0/1.8V)) 60(COEX3_(0/1.8V))* 61(ANTCTL1_(0/1.8V))* 62(COEX_TXD_(0/1.8V))* 63(ANTCTL2_(0/1.8V)) 64(COEX_RXD_(0/1.8V))* 65(ANTCTL3_(0/1.8V)) 66(SIM_DETECT)* 67(RESET#_(0/1.8V)) 68(SUSCLK(32kHz)_(0/3.3V))* 75(CONFIG_2)*

### Layout directives
differential pair: GTR1_RX_N, GTR1_RX_P, GTR1_RXC_N, GTR1_RXC_P, GTR1_TX_N, GTR1_TX_P, GTR1_TXC_N, GTR1_TXC_P
net class MGT: GTR1_RX_N, GTR1_RX_P, GTR1_RXC_N, GTR1_RXC_P, GTR1_TX_N, GTR1_TX_P, GTR1_TXC_N, GTR1_TXC_P
net class PWR: NetC15_2, NetC16_2

### Notes on the sheet
- TODO: Place footprint of M.2 cage?
- (near X10) SATA SSDs only (Gen3, up to 6 Gbps)
- Note: SATA RX is reversed...
- MFG_DAT
- MFG_CLK
- TODO: Also place 42mm option for short SSDs?
- Title
- Revision:
- Design Engineer:
- Date:
- Project:
- Sheet
- of
- (in symbol 1-2199230-5) Key B; Platform Side Pinout
- (in symbol M.2 NGFF Socket 2280BM) NGFF Snap

### Library data of the parts
C13A C13B C13C C13D = UZgen_C_0402_100nF_50V_X7R: Generic capacitor; Manufacturer: UZgen; Voltage: 50V; Tolerance: 10 %; Created from: UZgenTool; Manufacturer Part Number: UZgen_C_0402_100nF_50V_X7R; PartID: 3431; Created On: 02/08/2024 11:17:51; Value: 100 nF; Device Package: 0402; Technology: X7R; Mounting Type: SMD; Last Updated: 02/08/2024 11:17:51
C15 C16 = CL10A106MO8NQNC: Capacitor 0603, 16 VDC, 10 µF, X5R; Manufacturer: Samsung Electro-Mechanics; Tolerance: 20 %; Voltage Rating: 16 VDC; Created from: AGeiger; Manufacturer Part Number: CL10A106MO8NQNC; PartID: 101; Created On: 22/08/2022 13:56:44; ComponentLink1Description: Datasheet; ComponentLink1URL: https://datasheet.lcsc.com/lcsc/1810261909_Samsung-Electro-Mechanics-CL10A106MO8NQNC_C92487.pdf; Component Type: Capacitor 0603; Device Package: 0603; Last Updated: 19/11/2024 12:40:46; Mounting Type: SMD; Operating Temperature: -55 - 85°C; Supplier 1: LCSC; Supplier Part Number 1: C92487; Type: Capacitor; Value: 10 µF; Live Cycle Status: 1; LCSC Part Number: C92487; Series: X5R
C17 C18 = UZgen_C_0603_100nF_50V_X7R: Generic capacitor; Manufacturer: UZgen; Voltage: 50V; Tolerance: 10 %; Created from: AGeiger; Manufacturer Part Number: UZgen_C_0603_100nF_50V_X7R; PartID: 1; Created On: 02/07/2024 14:42:23; Value: 100 nF; Device Package: 0603; Technology: X7R; Mounting Type: SMD; Last Updated: 08/08/2024 15:01:15
C19 C20 = UZgen_C_0603_10nF_50V_X7R: Generic capacitor; Manufacturer: UZgen; Tolerance: 10 %; Created from: UZgenTool; Voltage: 50V; Manufacturer Part Number: UZgen_C_0603_10nF_50V_X7R; PartID: 4263; Created On: 02/08/2024 11:18:09; Device Package: 0603; Last Updated: 02/08/2024 11:18:09; Mounting Type: SMD; Value: 10 nF; Technology: X7R
L4 L5 = UPZ2012E601-2R0TF: 2A 1 90mΩ 600Ω@100MHz ±25% 0805  Ferrite Beads ROHS; Manufacturer: Sunlord; Value: 90 Ohm; Created from: AGeiger; Manufacturer Part Number: UPZ2012E601-2R0TF; PartID: 11; Created On: 03.09.2022 16:57:01; ComponentLink1Description: Datasheet; ComponentLink1URL: https://datasheet.lcsc.com/lcsc/2110091730_Sunlord-UPZ2012E601-2R0TF_C98308.pdf; Component Type: Ferrite Beads; Device Package: 0805; Last Updated: 03.09.2022 17:01:04; Mounting Type: SMD; Operating Temperature: -55 - 125 °C; Supplier 1: LCSC; Supplier Part Number 1: C98308; Type: Ferrite Bead; DC current: 2 A; Live Cycle Status: 1; LCSC Part Number: C98308
MECH2 = SMTSOM325BTR: SMD Nut; Manufacturer: YIYUAN; AN: 32101; Mixed: THT; H-ART: 9774025360; Temperature-Range: -55/+150 (Abs); Extra: WA-SMSI; Created from: AGeiger; HelpURL: B:\AD\adlib\datasheet\WE_9774025360; LCSC Part #: C5301784; Manufacturer Part Number: SMTSOM325BTR; PartID: 13; Created On: 06.06.2023 08:57:00; ComponentLink1Description: Datasheet; ComponentLink1URL: https://datasheet.lcsc.com/lcsc/2302021209_YIYUAN-SMTSOM325BTR_C5301784.pdf; Last Updated: 06.06.2023 08:57:00; Mounting Type: SMD; Series: M2; Supplier 1: LCSC; Supplier Part Number 1: C5301784; Value: SMTSOM325BTR; LCSC Part Number: C5301784
R14 R15 = UZgen_R_0603_10k: Generic resistor; Manufacturer: UZgen; Tolerance: 1 %; Created from: AGeiger; Manufacturer Part Number: UZgen_R_0603_10k; PartID: 1; Created On: 02/07/2024 14:34:53; Value: 10k; Device Package: 0603; Mounting Type: SMD; Last Updated: 02/07/2024 14:37:16
TP3 = NULL: Manufacturer Part Number: NULL; Created from: AGeiger; Created: 2018_06_25_AGeiger; Value: Testpoint 1mm; PartID: 9; Created On: 20/09/2022 13:14:57; Component Type: Testpoint; Last Updated: 20/09/2022 13:15:39; Manufacturer: NULL; Supplier 1: NULL; Supplier Part Number 1: NULL; Type: Testpoint; Live Cycle Status: 1
X10 = 1-2199230-5: M.2 0.5mm Surface Mount 67 SMD,P=0.5mm Card Edge Connectors ROHS; Manufacturer: TE Connectivity; AN: 31952; Mixed: SMT; Temperature-Range: -40/+80; Extra: Socket 67pol. 4.2mm; Created from: AGeiger; Case: M.2 B; HelpURL: B:\AD\adlib\datasheet\TE\2199230-3; H-ART: 2199230-3; LCSC Part #: C590854; Manufacturer Part Number: 1-2199230-5; PartID: 12; Created On: 06.06.2023 08:54:40; ComponentLink1Description: Datasheet; ComponentLink1URL: https://datasheet.lcsc.com/lcsc/2008241633_TE-Connectivity-1-2199230-5_C590854.pdf; Last Updated: 06.06.2023 08:54:40; Mounting Type: SMD; Operating Temperature: -40 °C to +80 °C; Series: M2; Supplier 1: LCSC; Supplier Part Number 1: C590854; Value: 1-2199230-5; LCSC Part Number: C590854
X11 = M.2 NGFF Socket 2280BM: M.2 NGFF Socket 2280BM Snap; Manufacturer: n.a.; AN: 26274; Mixed: SMT; Extra: Variant of 25485; Created from: AGeiger; HelpURL: B:\AD\adlib\datasheet\1-2199119-0; Manufacturer Part Number: M.2 NGFF Socket 2280BM; PartID: 15; Created On: 06.06.2023 09:01:36; ComponentLink1Description: Datasheet; ComponentLink1URL: https://datasheet.lcsc.com/lcsc/2302021209_YIYUAN-SMTSOM325BTR_C5301784.pdf; Last Updated: 06.06.2023 09:04:37; Series: M2; Supplier 1: n.a.; Supplier Part Number 1: n.a.; Value: M.2 NGFF Socket 2280BM